# Altium schematic sheet Connector 2P.schdoc
size 124 x 101 mm
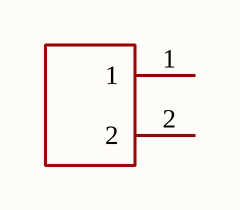
[diagram p0: Connector 2P.schdoc]

## Parts
CN?  B2B-PH-K-S(LF)(SN)  [CONN-TH_B2B-PH-K-S]  (value not drawn)

## Nets

Not connected (* = marked no-connect by the designer): CN? 1 2

## Library data of the parts
CN? = B2B-PH-K-S(LF)(SN): Manufacturer: JST; Add into BOM: yes; Pins Structure: 1x2P; Pitch: 2mm; Reference Series: PH; Number of PINs Per Row: 2; Current Rating (Max): 2A; Rated Voltage (Max): 100V; Plastic Material: PA66; Flame Retardant Rating: UL94V-0; Supplementary Features: K-leg punch; Z-Height of the Board: 6mm; X-Length of Bottom Edge on Board (Spacing Line): 5.9mm; Y-Width of Bottom Edge on Board: 4.5mm; Symbol: B2B-PH-K-S(LF)(SN); Device: B2B-PH-K-S(LF)(SN); LCSC Part Name: 1x2P 间距:2mm 直插 系列:PH; Supplier Part: C131337; Manufacturer Part: B2B-PH-K-S(LF)(SN); Supplier Footprint: 插件,P=2mm; JLCPCB Part Class: Extended Part; Datasheet: https://atta.szlcsc.com/upload/public/pdf/source/20171026/C131342_15089839687311058815.pdf; Supplier: LCSC; Convert to PCB: yes; Mounting Style: Direct Insert; Number of Pins: 2P; Number of Rows: 1; Row Spacing: -; Contact Material: Brass; Contact Plating: Tin; Operating Temperature Range: -25℃~+85℃; Colour: White